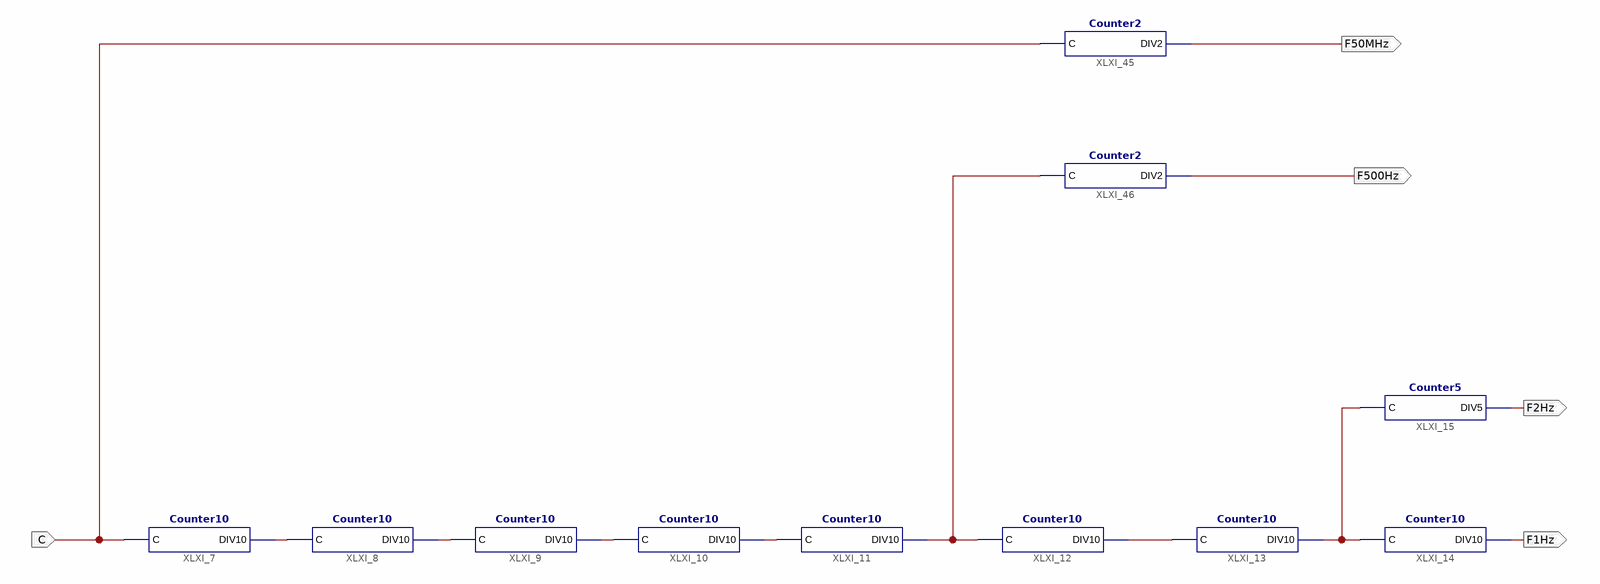
[diagram p0: schematic sheet 1]
// Xilinx ISE schematic Divider.sch (spartan6) as structural Verilog: 11 symbols, 5 ports
module Divider (
  input  C,
  output F1Hz,
  output F2Hz,
  output F500Hz,
  output F50MHz
);

  wire XLXN_6, XLXN_7, XLXN_8, XLXN_11, XLXN_20, XLXN_21, XLXN_25;

  Counter10 XLXI_7 (.C(C), .DIV10(XLXN_25));
  Counter10 XLXI_8 (.C(XLXN_25), .DIV10(XLXN_6));
  Counter10 XLXI_9 (.C(XLXN_6), .DIV10(XLXN_7));
  Counter10 XLXI_10 (.C(XLXN_7), .DIV10(XLXN_8));
  Counter10 XLXI_11 (.C(XLXN_8), .DIV10(XLXN_20));
  Counter10 XLXI_13 (.C(XLXN_21), .DIV10(XLXN_11));
  Counter10 XLXI_14 (.C(XLXN_11), .DIV10(F1Hz));
  Counter5 XLXI_15 (.C(XLXN_11), .DIV5(F2Hz));
  Counter10 XLXI_12 (.C(XLXN_20), .DIV10(XLXN_21));
  Counter2 XLXI_45 (.C(C), .DIV2(F50MHz));
  Counter2 XLXI_46 (.C(XLXN_20), .DIV2(F500Hz));
endmodule
